# Altium schematic sheet analog channel.schdoc
size A4; DrawnBy: SML; Revision: 0; SheetNumber: 2; Title2: Title2
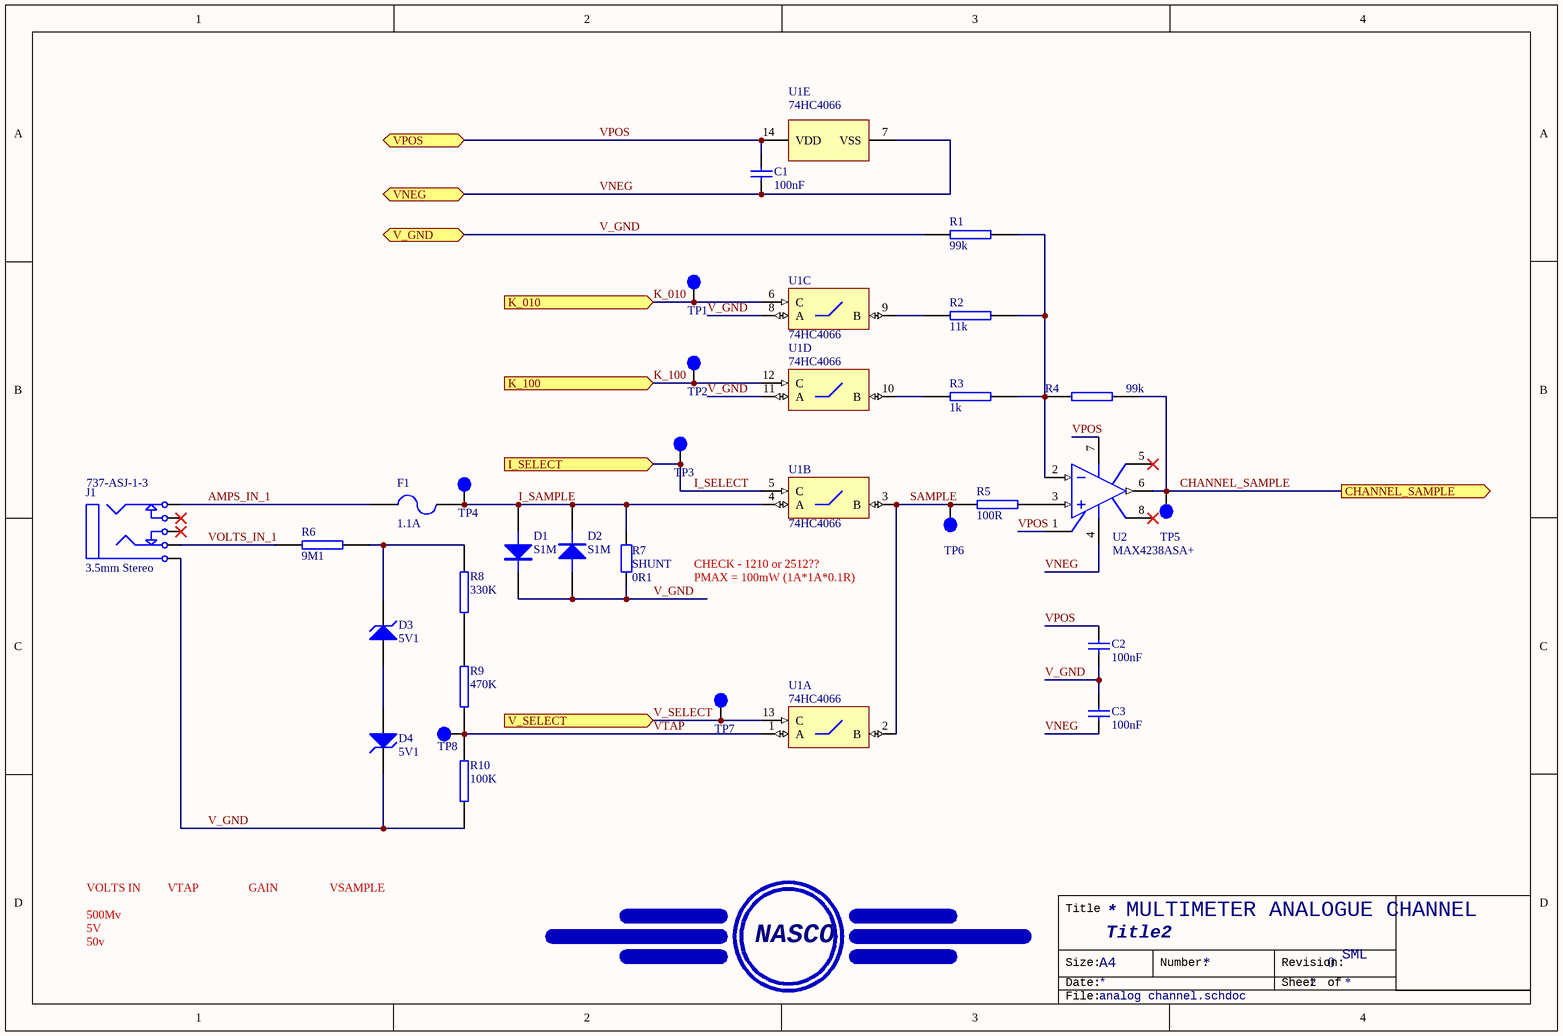
[diagram p0: analog channel.schdoc]

## Parts
?  (no value)  (no BOM)
C1  100nF  [CAP (3D) - 0603]
C2  100nF  [CAP (3D) - 0603]
C3  100nF  [CAP (3D) - 0603]
D1  S1M  [DO-214AC]
D2  S1M  [DO-214AC]
D3  5V1  [SOT23-3L]
D4  5V1  [SOT23-3L]
F1  1.1A  [LITTELFUSE 1210]
J1  3.5mm Stereo  Supplier Part Number 1: 737-ASJ-1-3  [3.5MM pcb mouNt]
R1  99k  [RES (3D) - 0603]
R2  11k  [RES (3D) - 0603]
R3  1k  [RES (3D) - 0603]
R4  99k  [RES (3D) - 0603]
R5  100R  [RES (3D) - 0603]
R6  9M1  [RES (3D) - 0603]
R7  SHUNT  value 0R1  [RES (3D) - 1210]
R8  330K  [RES (3D) - 0603]
R9  470K  [RES (3D) - 0603]
R10  100K  [RES (3D) - 0603]
TP1  TestPoint  [TP]  (value not drawn)
TP2  TestPoint  [TP]  (value not drawn)
TP3  TestPoint  [TP]  (value not drawn)
TP4  TestPoint  [TP]  (value not drawn)
TP5  TestPoint  [TP]  (value not drawn)
TP6  TestPoint  [TP]  (value not drawn)
TP7  TestPoint  [TP]  (value not drawn)
TP8  TestPoint  [TP]  (value not drawn)
U1  74HC4066  [DIP-16]  (parts A,B,C,D,E of 5)
U2  MAX4238ASA+  [SO-8]

## Ports
CHANNEL_SAMPLE (out), I_SELECT (in), K_010 (in), K_100 (in), V_GND (bidir), V_SELECT (in), VNEG (bidir), VPOS (bidir)

## Nets
AMPS_IN_1: F1.1 J1.5
CHANNEL_SAMPLE: R4.2 TP5.1 U2.6(OUT) ; port CHANNEL_SAMPLE
I_SAMPLE: D1.1(A) D2.2(K) F1.2 R7.2 TP4.1 U1.4(A)
I_SELECT: TP3.1 U1.5(C) ; port I_SELECT
K_010: TP1.1 U1.6(C) ; port K_010
K_100: TP2.1 U1.12(C) ; port K_100
SAMPLE: R5.1 TP6.1 U1.2(B) U1.3(B)
V_GND: C2.1 C3.2 D1.2(K) D2.1(A) D4.2(K) J1.1 R1.1 R7.1 R10.2 U1.8(A) U1.11(A) ; port V_GND
V_SELECT: TP7.1 U1.13(C) ; port V_SELECT
VNEG: C1.1 C3.1 U1.7(VSS) U2.4(VEE) ; port VNEG
VOLTS_IN_1: J1.2 R6.1
VPOS: C1.2 C2.2 U1.14(VDD) U2.1(NULL) U2.7(VCC) ; port VPOS
VTAP: R9.2 R10.1 TP8.1 U1.1(A)
NetD3_1: D3.1(A) D4.1(A)
NetD3_2: D3.2(K) R6.2 R8.1
NetR1_2: R1.2 R2.2 R3.2 R4.1 U2.2(IN-)
NetR2_1: R2.1 U1.9(B)
NetR3_1: R3.1 U1.10(B)
NetR5_2: R5.2 U2.3(IN+)
NetR8_2: R8.2 R9.1

Not connected (* = marked no-connect by the designer): J1 3* 4*; U2 5(NULL)* 8(NC)*

## Notes on the sheet
- CHECK - 1210 or 2512??
- PMAX = 100mW (1A*1A*0.1R)
- VOLTS IN
- 500Mv
- VTAP
- GAIN
- VSAMPLE
- MULTIMETER ANALOGUE CHANNEL
- 5V
- 50v
- Title
- NASCO
- Size:
- Date:
- A4
- Number:
- Revision:
- Sheet
- of
- File:

## Library data of the parts
? = NASCO_LOGO: LOGO
C1-C3 = Cap: Capacitor; Value: 100nF; Supplier 1: Mouser; Supplier 2: Digi-Key; Supplier Part Number 1: 603-C0603ZRY5V9BB104; Supplier Part Number 2: 311-1343-2-ND
D1 D2 = DIODE: DIODE, POWER; Manufacturer: TAIWAN SEMI; Mouser Part no.: 821-S1M; Manufacturer Part No.: S1M; value: S1M; Web link: http://au.mouser.com/ProductDetail/Taiwan-Semiconductor/S1M/?qs=sGAEpiMZZMtEwUVCuofpuOlSmRjzJonf%252bmrIm0%252bGbjE%3d
D3 D4 = D Zener: Zener Diode; pin to pad: 2>3; Value: 5V1; Supplier 1: Mouser; Supplier Part Number 1: 625-BZX84C5V1-V; Supplier 2: Digi-Key; Supplier Part Number 2: BZX84C5V1-V-GS08CT-ND
F1 = Fuse 2: Fuse; Manufacturer: Littlefuse; Manufacturer Part No.: 1206L110THYR; Revision: July-2002: Re-released for DXP Platform.; Mouser Part No.: 576-1206L110THYR; Value: 1.1A; Web link: http://au.mouser.com/ProductDetail/Littelfuse/1206L110THYR/?qs=sGAEpiMZZMu7EFbsM1w0ne5Dyqsx7igC3NaPmo8Qtk8%3d
J1 = Phonejack Stereo SW: 3-Conductor Jack with 2 break contacts (normals) and 2 auxiliary make contacts; Altronics Part no.: P0073; Manufacturer: Neutrik; Manufacturer Part No.: NMJ6HFD2; Mouser Part no.: 550-20301; Web link: http://au.mouser.com/ProductDetail/Neutrik/NMJ6HFD2/?qs=y5MlCMoPWsng3r9W7xlRqw%3d%3d; Supplier 1: Mouser
R1-R5 = RES SMD 0603: RESISTOR SMD 0603
  R1 R4: value: 99k
  R2: value: 11k
  R3: value: 1k
  R5: value: 100R
R6 = RES SMD 0603 10k: RESISTOR SMD 0603 10k; Manufacturer: Vishay/Dale; Manufacturer Part No.: CRCW06038M06FKEA; Mouser Part no.: 71-CRCW0603-8.06M-E3; Web link: http://au.mouser.com/ProductDetail/Vishay/CRCW06038M06FKEA/?qs=y%252bMD5VLd6nuCUjzPeM%2fNuA%3d%3d; value: 9M1
R7 = Res2: Resistor; Published: 8-Jun-2000; LatestRevisionDate: 17-Jul-2002; LatestRevisionNote: Re-released for DXP Platform.; PackageReference: AXIAL-0.4; Publisher: Altium Limited; PackageDescription: Axial Device, Thru-Hole; 2 Leads; 0.4 in Pin Spacing
R8-R10 = RES SMD 0603 10k: RESISTOR SMD 0603 10k
  R8: value: 330K
  R9: value: 470K
  R10: value: 100K
U1 = 74HC4066: Quadruple Bilateral Analog Switch
U2 = MAX495CSA: Single Voltage-Feedback Operational Amplifier; Published: 23-Sep-2002; LatestRevisionDate: 13-Apr-2006; LatestRevisionNote: IPC-7351 Footprint Added.; DatasheetVersion: Rev 2; 9/96; PackageReference: NSO8; Publisher: Altium Limited; PackageDescription: 8-Pin Small Outline Integrated Circuit 1.27 mm Pitch; Code_JEDEC: MS-012-AA; Code_IPC: SOIC127P600-8; ComponentLink1Description: Manufacturer Link; ComponentLink1URL: http://www.maxim-ic.com/; ComponentLink2Description: Datasheet; ComponentLink2URL: http://pdfserv.maxim-ic.com/en/ds/MAX492-MAX495.pdf